# Altium project BT_Lamp_RC.PrjPcb
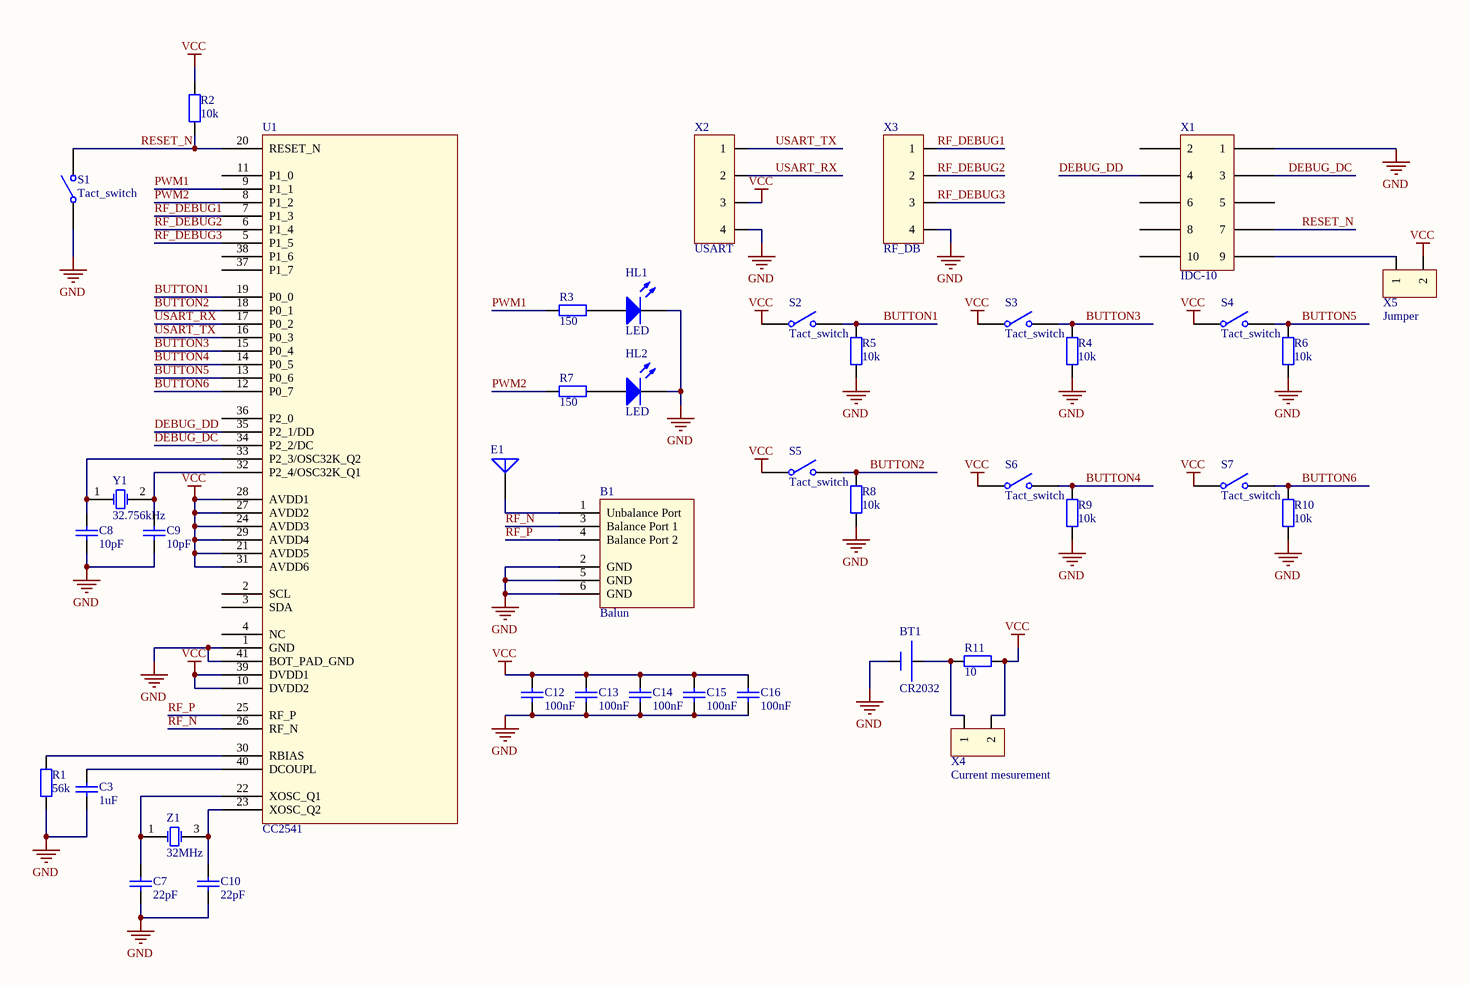
[diagram p0: BT_Lamp_RC.SchDoc]
1 sheet, 41 parts. Net scope: global (net labels, ports and power ports of the same name join across sheets).
Board file: BT_Lamp_RC.PcbDoc

## Sheet BT_Lamp_RC.SchDoc
size A3

### Parts
B1  Balun  [2.4 Balun 50Ohm LFB182G45BG2D280]
BT1  CR2032  [BH-642(CR2032)]
C3  1uF  [C0603]
C7  22pF  [C0603]
C8  10pF  [C0603]
C9  10pF  [C0603]
C10  22pF  [C0603]
C12  100nF  [C0603]
C13  100nF  [C0603]
C14  100nF  [C0603]
C15  100nF  [C0603]
C16  100nF  [C0603]
E1  Antenna  [2.4 INF Antenna]  (value not drawn)
HL1  LED  [LED_0805]
HL2  LED  [LED_0805]
R1  56k  [R0603]
R2  10k  [R0603]
R3  150  [R0603]
R4  10k  [R0603]
R5  10k  [R0603]
R6  10k  [R0603]
R7  150  [R0603]
R8  10k  [R0603]
R9  10k  [R0603]
R10  10k  [R0603]
R11  10  [R0603]
S1  Tact_switch  [Tact_switch_smd]
S2  Tact_switch  [Tact_switch_smd]
S3  Tact_switch  [Tact_switch_smd]
S4  Tact_switch  [Tact_switch_smd]
S5  Tact_switch  [Tact_switch_smd]
S6  Tact_switch  [Tact_switch_smd]
S7  Tact_switch  [Tact_switch_smd]
U1  CC2541  [QFN40 6x6 0.5pitch]
X1  IDC-10  [IDC-10]
X2  USART  [Pins 4x2.54]
X3  RF_DB  [Pins 4x2.54]
X4  Current mesurement  [Pins 2x2.54]
X5  Jumper  [Pins 2x2.54]
Y1  32.756kHz  [Geyer KX - 327S 32.768kHz]
Z1  32MHz  [kx 13 12MHz]

### Nets
GND: B1.2(GND) B1.5(GND) B1.6(GND) BT1.1 C3.1 C7.1 C8.1 C9.1 C10.1 C12.2 C13.2 C14.2 C15.2 C16.2 HL1.2(K) HL2.2(K) R1.1 R4.1 R5.1 R6.1 R8.1 R9.1 R10.1 S1.1(COMMON) U1.1(GND) U1.41(BOT_PAD_GND) X1.1 X2.4 X3.4
VCC: C12.1 C13.1 C14.1 C15.1 C16.1 R2.2 R11.2 S2.1(COMMON) S3.1(COMMON) S4.1(COMMON) S5.1(COMMON) S6.1(COMMON) S7.1(COMMON) U1.10(DVDD2) U1.21(AVDD5) U1.24(AVDD3) U1.27(AVDD2) U1.28(AVDD1) U1.29(AVDD4) U1.31(AVDD6) U1.39(DVDD1) X2.3 X4.2 X5.2
BUTTON1: R5.2 S2.2(NO) U1.19(P0_0)
BUTTON2: R8.2 S5.2(NO) U1.18(P0_1)
BUTTON3: R4.2 S3.2(NO) U1.15(P0_4)
BUTTON4: R9.2 S6.2(NO) U1.14(P0_5)
BUTTON5: R6.2 S4.2(NO) U1.13(P0_6)
BUTTON6: R10.2 S7.2(NO) U1.12(P0_7)
DEBUG_DC: U1.34(P2_2/DC) X1.3
DEBUG_DD: U1.35(P2_1/DD) X1.4
PWM1: R3.2 U1.9(P1_1)
PWM2: R7.2 U1.8(P1_2)
RESET_N: R2.1 S1.2(NO) U1.20(RESET_N) X1.7
RF_DEBUG1: U1.7(P1_3) X3.1
RF_DEBUG2: U1.6(P1_4) X3.2
RF_DEBUG3: U1.5(P1_5) X3.3
RF_N: B1.3(Balance_Port_1) U1.26(RF_N)
RF_P: B1.4(Balance_Port_2) U1.25(RF_P)
USART_RX: U1.17(P0_2) X2.2
USART_TX: U1.16(P0_3) X2.1
NetB1_1: B1.1(Unbalance_Port) E1.1(A)
NetBT1_2: BT1.2 R11.1 X4.1
NetC3_2: C3.2 U1.40(DCOUPL)
NetC7_2: C7.2 U1.22(XOSC_Q1) Z1.1(OSC1)
NetC8_2: C8.2 U1.33(P2_3/OSC32K_Q2) Y1.1(OSC1)
NetC9_2: C9.2 U1.32(P2_4/OSC32K_Q1) Y1.2(OSC2)
NetC10_2: C10.2 U1.23(XOSC_Q2) Z1.3(OSC2)
NetHL1_1: HL1.1(A) R3.1
NetHL2_1: HL2.1(A) R7.1
NetR1_2: R1.2 U1.30(RBIAS)
NetX1_9: X1.9 X5.1

Not connected (* = marked no-connect by the designer): U1 2(SCL) 3(SDA) 4(NC) 11(P1_0) 36(P2_0) 37(P1_7) 38(P1_6); X1 2 5 6 8 10

### Library data of the parts
B1 = 2.4 Balun 50Ohm LFB182G45BG2D280
BT1 = CR2032_Holder_BH-642
C3 C7-C10 C12-C16 = Condensator
R1-R11 = Resistor
X2 X3 = Pins 4x2.54
X4 X5 = Pins 2x2.54
Y1 = Crystal Oscillator
Z1 = KX 13 Geyer